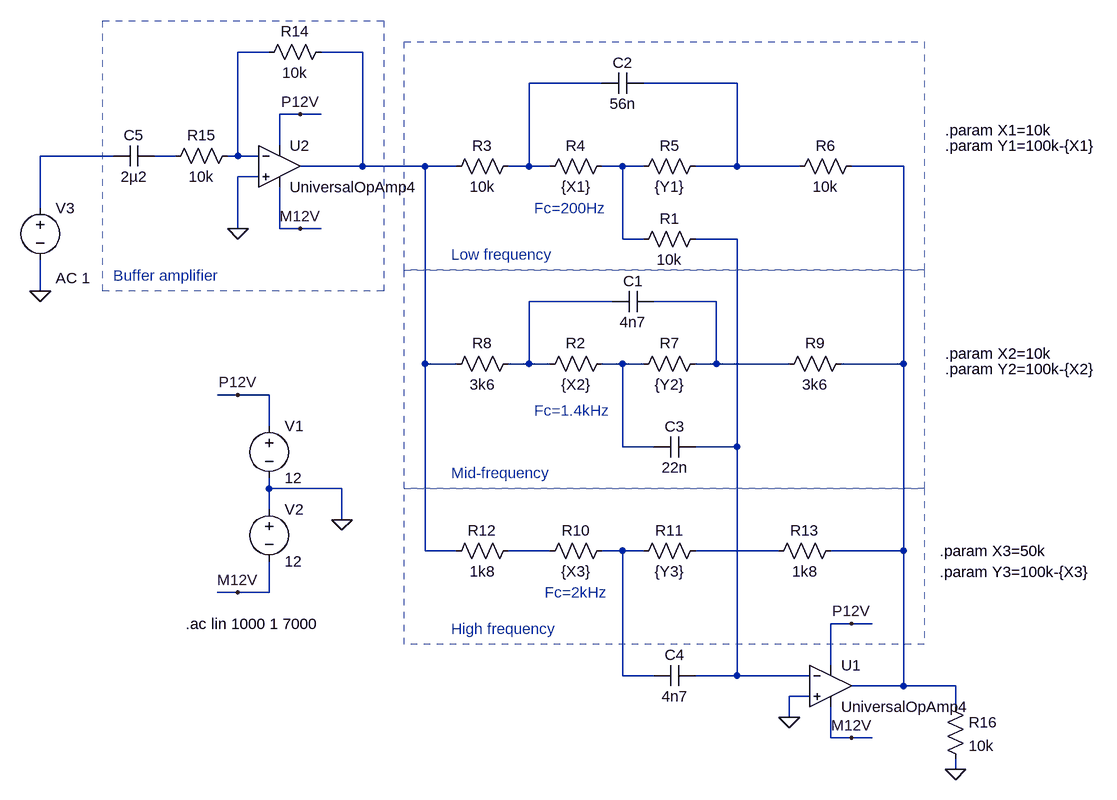
[diagram p0: schematic 3_band_eq_fr.asc]
3_band_eq_fr.asc, the LTspice schematic file:
Version 4
SHEET 1 1524 1028
WIRE 32 -176 -16 -176
WIRE 176 -176 112 -176
WIRE 544 -128 432 -128
WIRE 752 -128 608 -128
WIRE 80 -80 48 -80
WIRE 112 -80 80 -80
WIRE 48 -32 48 -80
WIRE -208 -16 -320 -16
WIRE -112 -16 -144 -16
WIRE -16 -16 -16 -176
WIRE -16 -16 -32 -16
WIRE 16 -16 -16 -16
WIRE 176 0 176 -176
WIRE 176 0 80 0
WIRE 272 0 176 0
WIRE 320 0 272 0
WIRE 432 0 432 -128
WIRE 432 0 400 0
WIRE 464 0 432 0
WIRE 576 0 544 0
WIRE 608 0 576 0
WIRE 752 0 752 -128
WIRE 752 0 688 0
WIRE 848 0 752 0
WIRE 1008 0 928 0
WIRE 16 16 -16 16
WIRE -320 64 -320 -16
WIRE -16 96 -16 16
WIRE 48 96 48 32
WIRE 80 96 48 96
WIRE 112 96 80 96
WIRE 576 112 576 0
WIRE 608 112 576 112
WIRE 752 112 688 112
WIRE -320 192 -320 144
WIRE 560 208 432 208
WIRE 720 208 624 208
WIRE 272 304 272 0
WIRE 320 304 272 304
WIRE 432 304 432 208
WIRE 432 304 400 304
WIRE 464 304 432 304
WIRE 576 304 544 304
WIRE 608 304 576 304
WIRE 720 304 720 208
WIRE 720 304 688 304
WIRE 832 304 720 304
WIRE 1008 304 1008 0
WIRE 1008 304 912 304
WIRE -16 352 -48 352
WIRE 32 352 -16 352
WIRE 32 400 32 352
WIRE 576 432 576 304
WIRE 624 432 576 432
WIRE 752 432 752 112
WIRE 752 432 688 432
WIRE 32 496 32 480
WIRE 144 496 32 496
WIRE 32 528 32 496
WIRE 144 544 144 496
WIRE 272 592 272 304
WIRE 320 592 272 592
WIRE 464 592 400 592
WIRE 576 592 544 592
WIRE 608 592 576 592
WIRE 816 592 688 592
WIRE 1008 592 1008 304
WIRE 1008 592 896 592
WIRE -16 656 -48 656
WIRE 32 656 32 608
WIRE 32 656 -16 656
WIRE 928 704 896 704
WIRE 960 704 928 704
WIRE 896 768 896 704
WIRE 576 784 576 592
WIRE 624 784 576 784
WIRE 752 784 752 432
WIRE 752 784 688 784
WIRE 864 784 752 784
WIRE 1008 800 1008 592
WIRE 1008 800 928 800
WIRE 1088 800 1008 800
WIRE 864 816 832 816
WIRE 1088 832 1088 800
WIRE 832 848 832 816
WIRE 896 880 896 832
WIRE 928 880 896 880
WIRE 960 880 928 880
WIRE 1088 928 1088 912
FLAG 144 544 0
FLAG -16 352 P12V
FLAG -16 656 M12V
FLAG -320 192 0
FLAG 832 848 0
FLAG 1088 928 0
FLAG 928 704 P12V
FLAG 928 880 M12V
FLAG 80 -80 P12V
FLAG 80 96 M12V
FLAG -16 96 0
SYMBOL voltage 32 384 R0
WINDOW 123 0 0 Left 0
WINDOW 39 0 0 Left 0
SYMATTR InstName V1
SYMATTR Value 12
SYMBOL voltage 32 512 R0
WINDOW 123 0 0 Left 0
WINDOW 39 0 0 Left 0
SYMATTR InstName V2
SYMATTR Value 12
SYMBOL voltage -320 48 R0
WINDOW 123 24 124 Left 2
WINDOW 39 0 0 Left 0
WINDOW 3 24 152 Left 2
SYMATTR Value2 AC 1
SYMATTR Value ""
SYMATTR InstName V3
SYMBOL res 416 -16 R90
WINDOW 0 0 56 VBottom 2
WINDOW 3 32 56 VTop 2
SYMATTR InstName R3
SYMATTR Value 10k
SYMBOL res 560 -16 R90
WINDOW 0 0 56 VBottom 2
WINDOW 3 32 56 VTop 2
SYMATTR InstName R4
SYMATTR Value {X1}
SYMBOL res 704 -16 R90
WINDOW 0 0 56 VBottom 2
WINDOW 3 32 56 VTop 2
SYMATTR InstName R5
SYMATTR Value {Y1}
SYMBOL res 944 -16 R90
WINDOW 0 0 56 VBottom 2
WINDOW 3 32 56 VTop 2
SYMATTR InstName R6
SYMATTR Value 10k
SYMBOL cap 608 -144 R90
WINDOW 0 0 32 VBottom 2
WINDOW 3 32 32 VTop 2
SYMATTR InstName C2
SYMATTR Value 56n
SYMBOL res 1072 816 R0
SYMATTR InstName R16
SYMATTR Value 10k
SYMBOL OpAmps\\UniversalOpAmp4 896 800 R0
SYMATTR InstName U1
SYMBOL res 704 96 R90
WINDOW 0 0 56 VBottom 2
WINDOW 3 32 56 VTop 2
SYMATTR InstName R1
SYMATTR Value 10k
SYMBOL res 560 288 R90
WINDOW 0 0 56 VBottom 2
WINDOW 3 32 56 VTop 2
SYMATTR InstName R2
SYMATTR Value {X2}
SYMBOL res 704 288 R90
WINDOW 0 0 56 VBottom 2
WINDOW 3 32 56 VTop 2
SYMATTR InstName R7
SYMATTR Value {Y2}
SYMBOL cap 624 192 R90
WINDOW 0 0 32 VBottom 2
WINDOW 3 32 32 VTop 2
SYMATTR InstName C1
SYMATTR Value 4n7
SYMBOL cap 688 416 R90
WINDOW 0 0 32 VBottom 2
WINDOW 3 32 32 VTop 2
SYMATTR InstName C3
SYMATTR Value 22n
SYMBOL res 416 288 R90
WINDOW 0 0 56 VBottom 2
WINDOW 3 32 56 VTop 2
SYMATTR InstName R8
SYMATTR Value 3k6
SYMBOL res 928 288 R90
WINDOW 0 0 56 VBottom 2
WINDOW 3 32 56 VTop 2
SYMATTR InstName R9
SYMATTR Value 3k6
SYMBOL res 560 576 R90
WINDOW 0 0 56 VBottom 2
WINDOW 3 32 56 VTop 2
SYMATTR InstName R10
SYMATTR Value {X3}
SYMBOL res 704 576 R90
WINDOW 0 0 56 VBottom 2
WINDOW 3 32 56 VTop 2
SYMATTR InstName R11
SYMATTR Value {Y3}
SYMBOL res 416 576 R90
WINDOW 0 0 56 VBottom 2
WINDOW 3 32 56 VTop 2
SYMATTR InstName R12
SYMATTR Value 1k8
SYMBOL res 912 576 R90
WINDOW 0 0 56 VBottom 2
WINDOW 3 32 56 VTop 2
SYMATTR InstName R13
SYMATTR Value 1k8
SYMBOL cap 688 768 R90
WINDOW 0 0 32 VBottom 2
WINDOW 3 32 32 VTop 2
SYMATTR InstName C4
SYMATTR Value 4n7
SYMBOL OpAmps\\UniversalOpAmp4 48 0 R0
SYMATTR InstName U2
SYMBOL res 128 -192 R90
WINDOW 0 0 56 VBottom 2
WINDOW 3 32 56 VTop 2
SYMATTR InstName R14
SYMATTR Value 10k
SYMBOL res -16 -32 R90
WINDOW 0 0 56 VBottom 2
WINDOW 3 32 56 VTop 2
SYMATTR InstName R15
SYMATTR Value 10k
SYMBOL cap -144 -32 R90
WINDOW 0 0 32 VBottom 2
WINDOW 3 32 32 VTop 2
SYMATTR InstName C5
SYMATTR Value 2µ2
TEXT -96 704 Left 2 !.ac lin 1000 1 7000
TEXT 440 64 Left 2 ;Fc=200Hz
TEXT 440 376 Left 2 ;Fc=1.4kHz
TEXT 456 656 Left 2 ;Fc=2kHz
TEXT 312 136 Left 2 ;Low frequency
TEXT 312 472 Left 2 ;Mid-frequency
TEXT 312 712 Left 2 ;High frequency
TEXT -208 168 Left 2 ;Buffer amplifier
TEXT 1072 -56 Left 2 !.param X1=10k
TEXT 1072 -32 Left 2 !.param Y1=100k-{X1}
TEXT 1072 288 Left 2 !.param X2=10k
TEXT 1072 312 Left 2 !.param Y2=100k-{X2}
TEXT 1064 592 Left 2 !.param X3=50k
TEXT 1064 624 Left 2 !.param Y3=100k-{X3}
RECTANGLE Normal 1040 160 240 -192 2
RECTANGLE Normal 1040 496 240 160 2
RECTANGLE Normal 1040 736 240 496 2
RECTANGLE Normal 208 192 -224 -224 2

The netlist it stands for:
* 3_band_eq_fr.asc
V1 P12V 0 12
V2 0 M12V 12
V3 N005 0 AC 1
R3 N003 N002 10k
R4 N007 N003 {X1}
R5 N004 N007 {Y1}
R6 N008 N004 10k
C2 N004 N003 56n
R16 N008 0 10k
* U1: UniversalOpAmp4 (symbol OpAmps\UniversalOpAmp4 not available, pins judged from their places): In+=0 In-=N009 V+=P12V V-=M12V OUT=N008
R1 N009 N007 10k
R2 N012 N010 {X2}
R7 N011 N012 {Y2}
C1 N011 N010 4n7
C3 N009 N012 22n
R8 N010 N002 3k6
R9 N008 N011 3k6
R10 N014 N013 {X3}
R11 N015 N014 {Y3}
R12 N013 N002 1k8
R13 N008 N015 1k8
C4 N009 N014 4n7
* U2: UniversalOpAmp4 (symbol OpAmps\UniversalOpAmp4 not available, pins judged from their places): In+=0 In-=N001 V+=P12V V-=M12V OUT=N002
R14 N002 N001 10k
R15 N001 N006 10k
C5 N006 N005 2µ2
.ac lin 1000 1 7000
* Fc=200Hz
* Fc=1.4kHz
* Fc=2kHz
* Low frequency
* Mid-frequency
* High frequency
* Buffer amplifier
.param X1=10k
.param Y1=100k-{X1}
.param X2=10k
.param Y2=100k-{X2}
.param X3=50k
.param Y3=100k-{X3}
.backanno
.end